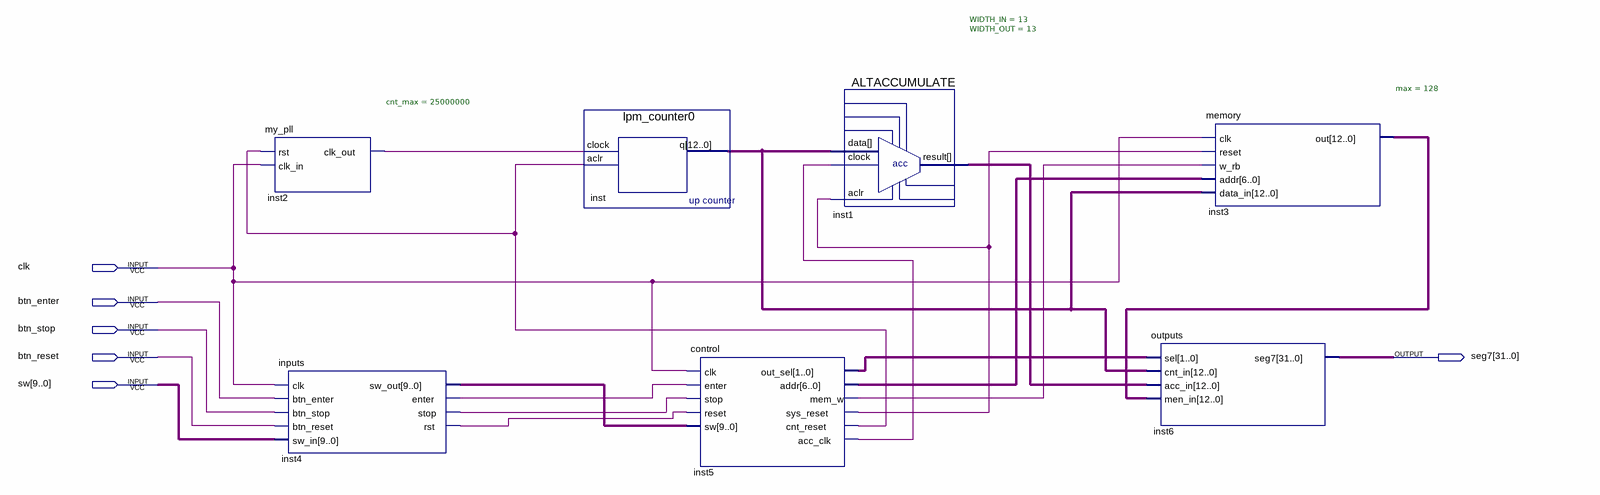
[diagram p0: schematic sheet]
// Quartus schematic lab1.bdf as structural Verilog: 7 symbols, 6 pins
module lab1 (
  input  clk,
  input  btn_enter,
  input  btn_stop,
  input  btn_reset,
  input  [9:0] sw,
  output [31:0] seg7
);

  wire inst2_clk_out, inst4_enter, inst4_rst, inst4_stop, inst5_acc_clk, inst5_cnt_reset, inst5_mem_w,
       inst5_sys_reset;
  wire [1:0] inst5_out_sel;
  wire [6:0] inst5_addr;
  wire [9:0] inst4_sw_out;
  wire [12:0] inst1_result, inst3_out, inst_q;

  my_pll #(.cnt_max(25000000)) inst2 (.rst(inst5_cnt_reset), .clk_in(clk), .clk_out(inst2_clk_out));
  inputs inst4 (
    .clk(clk), .btn_enter(btn_enter), .btn_stop(btn_stop), .btn_reset(btn_reset), .sw_in(sw),
    .sw_out(inst4_sw_out), .enter(inst4_enter), .stop(inst4_stop), .rst(inst4_rst));
  lpm_counter0 inst (.clock(inst2_clk_out), .aclr(inst5_cnt_reset), .q(inst_q));
  control inst5 (
    .clk(clk), .enter(inst4_enter), .stop(inst4_stop), .reset(inst4_rst), .sw(inst4_sw_out),
    .out_sel(inst5_out_sel), .addr(inst5_addr), .mem_w(inst5_mem_w), .sys_reset(inst5_sys_reset),
    .cnt_reset(inst5_cnt_reset), .acc_clk(inst5_acc_clk));
  ALTACCUMULATE #(.WIDTH_IN(13), .WIDTH_OUT(13)) inst1 (
    .aclr(inst5_sys_reset), .clock(inst5_acc_clk), .data(inst_q), .result(inst1_result));
  outputs inst6 (.sel(inst5_out_sel), .cnt_in(inst_q), .acc_in(inst1_result), .men_in(inst3_out), .seg7(seg7));
  memory #(.max(128)) inst3 (
    .clk(clk), .reset(inst5_sys_reset), .w_rb(inst5_mem_w), .addr(inst5_addr), .data_in(inst_q),
    .out(inst3_out));
endmodule
